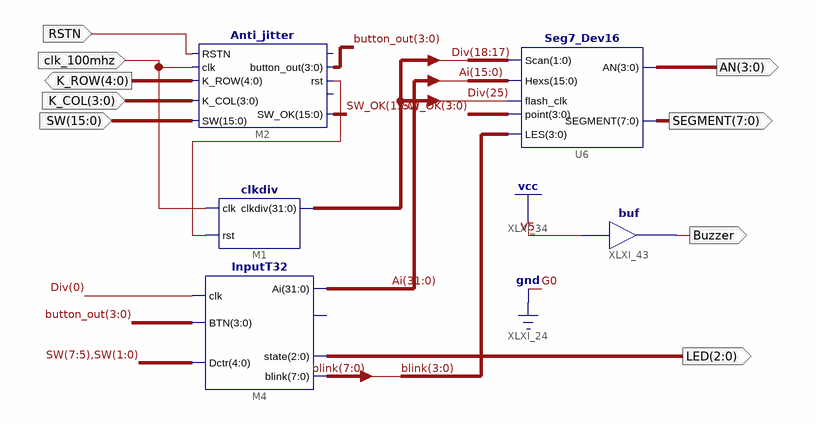
[diagram p0: schematic sheet 1]
// Xilinx ISE schematic I2Disp.sch (kintex7) as structural Verilog: 5 symbols, 9 ports
module I2Disp (
  input  clk_100mhz,
  input  [15:0] SW,
  input  [3:0] K_COL,
  input  RSTN,
  output [3:0] AN,
  output [7:0] SEGMENT,
  output [2:0] LED,
  output [4:0] K_ROW,
  output Buzzer
);

  wire XLXN_493;
  wire [3:0] button_out;
  wire [7:0] blink;
  wire [15:0] SW_OK;
  wire [31:0] Ai, Div;

  Anti_jitter M2 (
    .SW_OK(SW_OK), .SW(SW), .K_COL(K_COL), .K_ROW(K_ROW), .clk(clk_100mhz), .RSTN(RSTN), .rst(XLXN_493),
    .button_out(button_out));  // open: button_pulse, CR
  clkdiv M1 (.clkdiv(Div), .clk(clk_100mhz), .rst(XLXN_493));
  InputT32 M4 (
    .clk(Div[0]), .BTN(button_out), .Dctr({SW[7:5], SW[1:0]}), .blink(blink), .state(LED), .Ai(Ai));  // open: Bi
  Seg7_Dev16 U6 (
    .Hexs(Ai[15:0]), .LES(blink[3:0]), .SEGMENT(SEGMENT), .Scan(Div[18:17]), .point(SW_OK[3:0]), .AN(AN),
    .flash_clk(Div[25]));
  buf XLXI_43 (Buzzer, 1'b1);
endmodule
